# Altium schematic sheet Relay-MOSFETs.SchDoc
size A
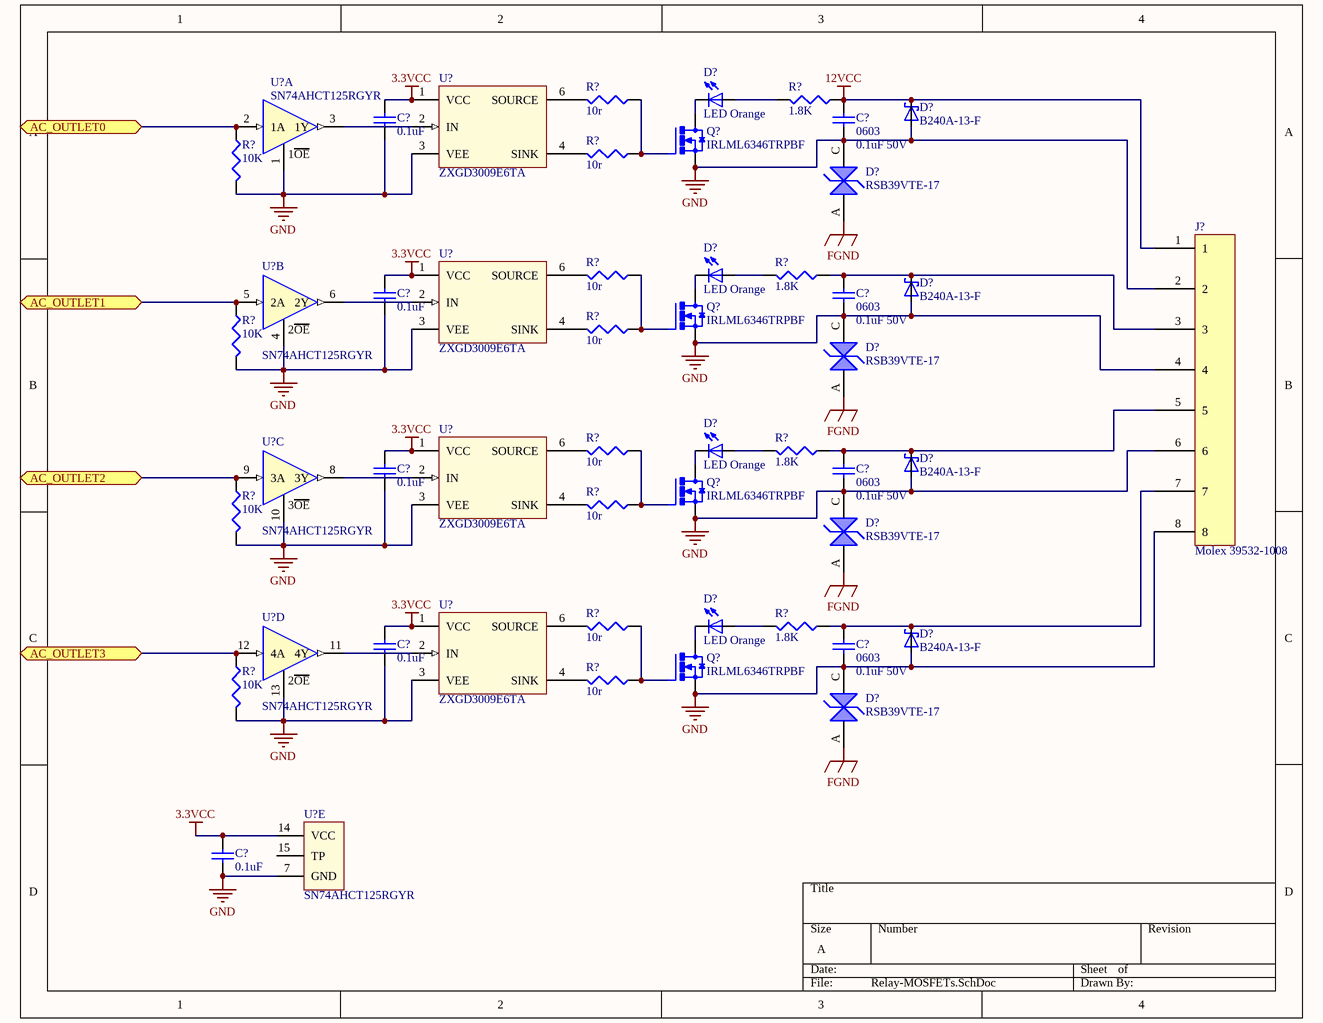
[diagram p0: Relay-MOSFETs.SchDoc]

## Parts
(Parts that share a designator on the sheet are numbered #1, #2 ... from top to bottom, then left to right.)
C?#1  0.1uF  [C0402]
C?#2  0603  value 0.1uF 50V  [C0603]
C?#3  0.1uF  [C0402]
C?#4  0603  value 0.1uF 50V  [C0603]
C?#5  0.1uF  [C0402]
C?#6  0603  value 0.1uF 50V  [C0603]
C?#7  0.1uF  [C0402]
C?#8  0603  value 0.1uF 50V  [C0603]
C?#9  0.1uF  [C0402]
D?#1  LED Orange  [LED0603_ORANGE]
D?#2  B240A-13-F  [B240A-13-F]
D?#3  RSB39VTE-17  [RSB39VTE-17]
D?#4  LED Orange  [LED0603_ORANGE]
D?#5  B240A-13-F  [B240A-13-F]
D?#6  RSB39VTE-17  [RSB39VTE-17]
D?#7  LED Orange  [LED0603_ORANGE]
D?#8  B240A-13-F  [B240A-13-F]
D?#9  RSB39VTE-17  [RSB39VTE-17]
D?#10  LED Orange  [LED0603_ORANGE]
D?#11  B240A-13-F  [B240A-13-F]
D?#12  RSB39VTE-17  [RSB39VTE-17]
J?  Molex 39532-1008  [39532-1008]
Q?#1  IRLML6346TRPBF
Q?#2  IRLML6346TRPBF
Q?#3  IRLML6346TRPBF
Q?#4  IRLML6346TRPBF
R?#1  10r  [R0402]
R?#2  1.8K  [R0402]
R?#3  10r  [R0402]
R?#4  10K  [R0402]
R?#5  10r  [R0402]
R?#6  1.8K  [R0402]
R?#7  10r  [R0402]
R?#8  10K  [R0402]
R?#9  10r  [R0402]
R?#10  1.8K  [R0402]
R?#11  10r  [R0402]
R?#12  10K  [R0402]
R?#13  10r  [R0402]
R?#14  1.8K  [R0402]
R?#15  10r  [R0402]
R?#16  10K  [R0402]
U?#1  SN74AHCT125RGYR  [SN74AHCT125RGYR]  (part A of 5)
U?#2  ZXGD3009E6TA  [ZXGD3009E6TA]
U?#3  ZXGD3009E6TA  [ZXGD3009E6TA]
U?#4  SN74AHCT125RGYR  [SN74AHCT125RGYR]  (part B of 5)
U?#5  SN74AHCT125RGYR  [SN74AHCT125RGYR]  (part C of 5)
U?#6  ZXGD3009E6TA  [ZXGD3009E6TA]
U?#7  SN74AHCT125RGYR  [SN74AHCT125RGYR]  (part D of 5)
U?#8  ZXGD3009E6TA  [ZXGD3009E6TA]
U?#9  SN74AHCT125RGYR  [SN74AHCT125RGYR]  (part E of 5)

## Ports
AC_OUTLET0, AC_OUTLET1, AC_OUTLET2, AC_OUTLET3

## Nets
3.3VCC: C?#1.2 C?#3.2 C?#5.2 C?#7.2 C?#9.2 U?#2.1(VCC) U?#3.1(VCC) U?#6.1(VCC) U?#8.1(VCC) U?#9.14(VCC)
12VCC: C?#2.2 D?#2.C J?.1 R?#2.1
FGND: D?#3.A D?#6.A D?#9.A D?#12.A
GND: C?#1.1 C?#2.1 C?#3.1 C?#4.1 C?#5.1 C?#6.1 C?#7.1 C?#8.1 C?#9.1 D?#2.A D?#3.C D?#5.A D?#6.C D?#8.A D?#9.C D?#11.A D?#12.C J?.2 J?.4 J?.6 J?.8 Q?#1.1(S) Q?#1.2(S) Q?#1.3(S) Q?#2.1(S) Q?#2.2(S) Q?#2.3(S) Q?#3.1(S) Q?#3.2(S) Q?#3.3(S) Q?#4.1(S) Q?#4.2(S) Q?#4.3(S) R?#4.2 R?#8.2 R?#12.2 R?#16.2 U?#1.1(1OE) U?#2.3(VEE) U?#3.3(VEE) U?#4.4(2OE) U?#5.10(3OE) U?#6.3(VEE) U?#7.13(4OE) U?#8.3(VEE) U?#9.7(GND)
AC_OUTLET0: R?#4.1 U?#1.2(1A) ; port AC_OUTLET0
AC_OUTLET1: R?#8.1 U?#4.5(2A) ; port AC_OUTLET1
AC_OUTLET2: R?#12.1 U?#5.9(3A) ; port AC_OUTLET2
AC_OUTLET3: R?#16.1 U?#7.12(4A) ; port AC_OUTLET3
NetC?#4_2: C?#4.2 D?#5.C J?.3 R?#6.1
NetC?#6_2: C?#6.2 D?#8.C J?.5 R?#10.1
NetC?#8_2: C?#8.2 D?#11.C J?.7 R?#14.1
NetD?#1_1: D?#1.1 R?#2.2
NetD?#1_2: D?#1.2 Q?#1.MB(D)
NetD?#4_1: D?#4.1 R?#6.2
NetD?#4_2: D?#4.2 Q?#2.MB(D)
NetD?#7_1: D?#7.1 R?#10.2
NetD?#7_2: D?#7.2 Q?#3.MB(D)
NetD?#10_1: D?#10.1 R?#14.2
NetD?#10_2: D?#10.2 Q?#4.MB(D)
NetQ?#1_4: Q?#1.4(G) R?#1.8 R?#3.8
NetQ?#2_4: Q?#2.4(G) R?#5.8 R?#7.8
NetQ?#3_4: Q?#3.4(G) R?#9.8 R?#11.8
NetQ?#4_4: Q?#4.4(G) R?#13.8 R?#15.8
NetR?#1_1: R?#1.1 U?#2.6(SOURCE)
NetR?#3_1: R?#3.1 U?#2.4(SINK)
NetR?#5_1: R?#5.1 U?#3.6(SOURCE)
NetR?#7_1: R?#7.1 U?#3.4(SINK)
NetR?#9_1: R?#9.1 U?#6.6(SOURCE)
NetR?#11_1: R?#11.1 U?#6.4(SINK)
NetR?#13_1: R?#13.1 U?#8.6(SOURCE)
NetR?#15_1: R?#15.1 U?#8.4(SINK)
NetU?#1_3: U?#1.3(1Y) U?#2.2(IN)
NetU?#3_2: U?#3.2(IN) U?#4.6(2Y)
NetU?#5_8: U?#5.8(3Y) U?#6.2(IN)
NetU?#7_11: U?#7.11(4Y) U?#8.2(IN)

Not connected (* = marked no-connect by the designer): U?#9 15(TP)

## Library data of the parts
C?#1 C?#3 C?#5 C?#7 C?#9 = CL05B104JP5NNNC: CAP CER 0.1UF 10V X7R 0402; MFR: Samsung Electro-Mechanics America, Inc.; Pin Count #: 2; Tolerance: 5%; Type: Passive/Ceramic Cap; Lead-Free ?: Yes; Voltage: 10; Designer: Adam Vadala-Roth; MFR #: CL05B104JP5NNNC; Status: Active; Mounting: SMT/SMD; Datasheet: https://www.samsungsem.com/kr/front/downloadcms.do?path=/kr/support/product-search/mlcc/__icsFiles/afieldfile/2014/11/05&fileName=C_CL05B104JP5NNNC.pdf; Height: 0.55mm; Cost: 0.00758 @ 10,000; Date Created: 2 Apr 2016; Last Modified: 2 Apr 2016; Value: 0.1uF
C?#2 C?#4 C?#6 C?#8 = CL10B104KB8SFNC: CAP CER 0.1UF 50V 10% X7R 0603; MFR: Samsung; Voltage: 50VDC; Published: 10 - Dec - 2014; LatestRevisionDate: April 2015; Component Type: Chip Capacitor; MFR Part #: CL10B104KB8SFNC; Part Description: CAP CER 0.1UF 50V 10% X7R 0603; Mounting Type: SMT 0603; Datasheet: http://www.samsungsem.com/kr/front/downloadcms.do?path=/kr/support/product-search/mlcc/__icsFiles/afieldfile/2014/11/05&fileName=S_CL10B104KB8SFNC.pdf; Height: 0.9mm; Tolerance: 10%; Digikey #: 1276-1936-1-ND; PackageReference: 0603
D?#1 D?#4 D?#7 D?#10 = LTST-C191KFKT: LED ORANGE CLEAR 0603 SMD; MFR: Lite-On Inc.; Pin Count #: 2; Type: Passive/LED; Lead-Free ?: yes; Voltage: 2V; Designer: Adam Vadala-Roth; MFR #: LTST-C191KFKT; Status: Active; Mounting: SMT/SMD; Datasheet: http://optoelectronics.liteon.com/upload/download/DS22-2000-222/S_110_LTST-C191KFKT.pdf; Height: 0.55mm; Tolerance: N/A; Cost: 0.03760 @ 5000; Date Created: 4 Apr 2016; Last Modified: 4 Apr 2016; Value: LED Orange
D?#2 D?#5 D?#8 D?#11 = B240A-13-F: DIODE SCHOTTKY 40V 2A SMA; MFR: Diodes-Incorporated; Pin Count #: 2; Type: Schottky Diode; Lead-Free ?: Yes; Designer: Adam Vadala-Roth; MFR #: B240A-13-F; Status: Active; Mounting: SMT/SMD; Datasheet: http://www.diodes.com/_files/datasheets/ds13004.pdf; Height: 2.3mm; Tolerance: *; Cost: 0.0935 @ 10K; Voltage: 40V; Date Created: 6 May 2016; Last Modified: 6 May 2016
D?#3 D?#6 D?#9 D?#12 = RSB39VTE-17: TVS DIODE 30VWM SOD323; MFR: Rohm-Semiconductor; Pin Count #: 2; Lead-Free ?: Yes; Voltage: 30V; Designer: Adam Vadala-Roth; MFR #: RSB39VTE-17; Status: Active; Mounting: SMT/SMD; Datasheet: http://rohmfs.rohm.com/en/products/databook/datasheet/discrete/diode/zener/rsb39v.pdf; Height: 0.9mm; Tolerance: *; Cost: 0.07326 @ 6K; Type: TVS Diode; Date Created: 6 May 2016; Last Modified: 6 May 2016
J? = 39532-1008: 8 Position Terminal Block Header, Male Pins, Shrouded (4 Side) 0.200" (5.08mm) 90°, Right Angle Through Hole; Pin Count #: 8; Lead-Free ?: Yes; Voltage: 300V; Designer: Adam Vadala-Roth; MFR #: 39532-1008; MFR: Molex; Status: Active; Mounting: SMT/SMD; Datasheet: http://www.molex.com/pdm_docs/sd/395321002_sd.pdf; Height: 8.3mm; Tolerance: *; Cost: 1.26 @ 1000; Type: Terminal Block Header Connector; Date Created: 6 May 2016; Last Modified: 6 May 2016
Q?#1-Q?#4 = IRLML6346TRPBF: MOSFET N-CH 30V 3.4A SOT23; MFR: Infineon-Technologies-Americas-Corp.; Pin Count #: 3; Type: N-Channel MOSFET (NPN); Lead-Free ?: Yes; Designer: Adam Vadala-Roth; MFR #: IRLML6346TRPBF; Status: Active; Mounting: SMT/SMD; Datasheet: http://www.irf.com/product-info/datasheets/data/irlml6346pbf.pdf; Height: 1.12mm; Tolerance: *; Cost: 0.09720 @ 3000; Voltage: 30V; Date Created: 6 May 2016; Last Modified: 6 May 2016
R?#1 R?#3 R?#5 R?#7 R?#9 R?#11 R?#13 R?#15 = ERJ-2RKF10R0X: RES SMD 10 OHM 1% 1/10W 0402; MFR: Panasonic-Electronic-Components; Pin Count #: 2; Tolerance: 10 ohm; Lead-Free ?: Yes; Designer: Adam Vadala-Roth; MFR #: ERJ-2RKF10R0X; Status: Active; Mounting: SMT/SMD; Datasheet: http://industrial.panasonic.com/cdbs/www-data/pdf/RDA0000/AOA0000C86.pdf; Height: 0.4mm; Cost: 0.00355 @ 1000; Type: Chip Resistor / Passive; Voltage: 1/10W; Date Created: 6 May 2016; Last Modified: 6 May 2016; Value: 10r
R?#2 R?#6 R?#10 R?#14 = RC1005F182CS: RES SMD 1.8K OHM 1% 1/16W 0402; MFR: Samsung-Electro-Mechanics-America,-Inc; Pin Count #: 2; Lead-Free ?: Yes; Designer: Adam Vadala-Roth; MFR #: RC1005F182CS; Status: Active; Mounting: SMT/SMD; Datasheet: https://media.digikey.com/pdf/Data%20Sheets/Samsung%20PDFs/RC_Series_ds.pdf; Height: 0.4mm; Tolerance: 1%; Cost: 0.00203 @ 10K; Type: Passive/ Chip Resistor; Voltage: 1/16W; Date Created: 6 May 2016; Last Modified: 2 May 2016; Value: 1.8K
R?#4 R?#8 R?#12 R?#16 = RC1005F103CS: RES SMD 10K OHM 1% 1/16W 0402; MFR: Samsung Electro-Mechanics America, Inc.; Pin Count #: 2; Lead-Free ?: Yes; Designer: Adam Vadala-Roth; MFR #: RC1005F103CS; Status: Active; Mounting: SMT/SMD; Datasheet: https://media.digikey.com/pdf/Data%20Sheets/Samsung%20PDFs/RC_Series_ds.pdf; Height: 0.4mm; Tolerance: 1%; Cost: 0.00137	 @ 10000; Type: Passive / Chip Resistor; Voltage: 1/16W; Date Created: 3 Apr 2016; Last Modified: 3 Apr 2016; Value: 10K
U?#1 U?#4 U?#5 U?#7 U?#9 = SN74AHCT125RGYR: IC BUS BUFFER TRI-ST QD 14VQFN; MFR: Texas Instruments; Pin Count #: 15; Lead-Free ?: Yes; Voltage: 3.3V / 5V; Designer: Adam Vadala-Roth; MFR #: SN74AHCT125RGYR; Status: Active; Mounting: SMT/SMD; Datasheet: http://www.ti.com/lit/ds/symlink/sn74ahct125.pdf; Height: 1mm; Tolerance: *; Cost: 0.116 @ 15K; Type: 74 Logic IC; Date Created: 6 May 2016; Last Modified: 6 May 2016
U?#2 U?#3 U?#6 U?#8 = ZXGD3009E6TA: IC GATE DRVR IGBT/MOSFET SOT23-6; MFR: Diodes-Incorporated; Pin Count #: 6; Lead-Free ?: Yes; Voltage: 40V MAX; Designer: Adam Vadala-Roth; MFR #: ZXGD3009E6TA; Status: Active; Mounting: SMT/SMD; Datasheet: http://www.diodes.com/_files/datasheets/ZXGD3009E6.pdf; Height: 1.3mm; Tolerance: *; Cost: 0.121 @ 6K; Type: MOSFET Gate Driver IC; Date Created: 6 May 2016; Last Modified: 6 May 2016